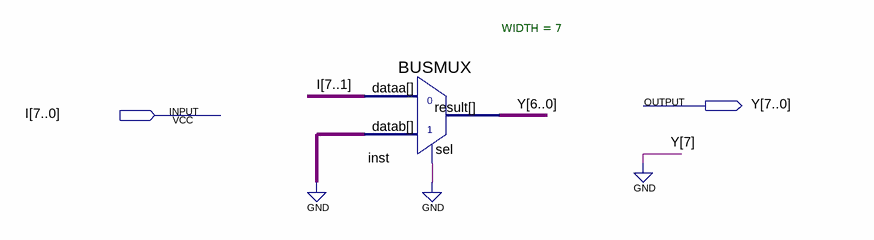
[diagram p0: schematic sheet]
// Quartus schematic SHIFTR1bit.bdf as structural Verilog: 1 symbols, 2 pins
module SHIFTR1bit (
  input  [7:0] I,
  output [7:0] Y
);

  BUSMUX #(.WIDTH(7)) inst (.datab({7{1'b0}}), .sel(1'b0), .dataa(I[7:1]), .result(Y[6:0]));

  assign Y[7] = 1'b0;
endmodule
